# EAGLE schematic data_proV2 (EAGLE 7.6.0)
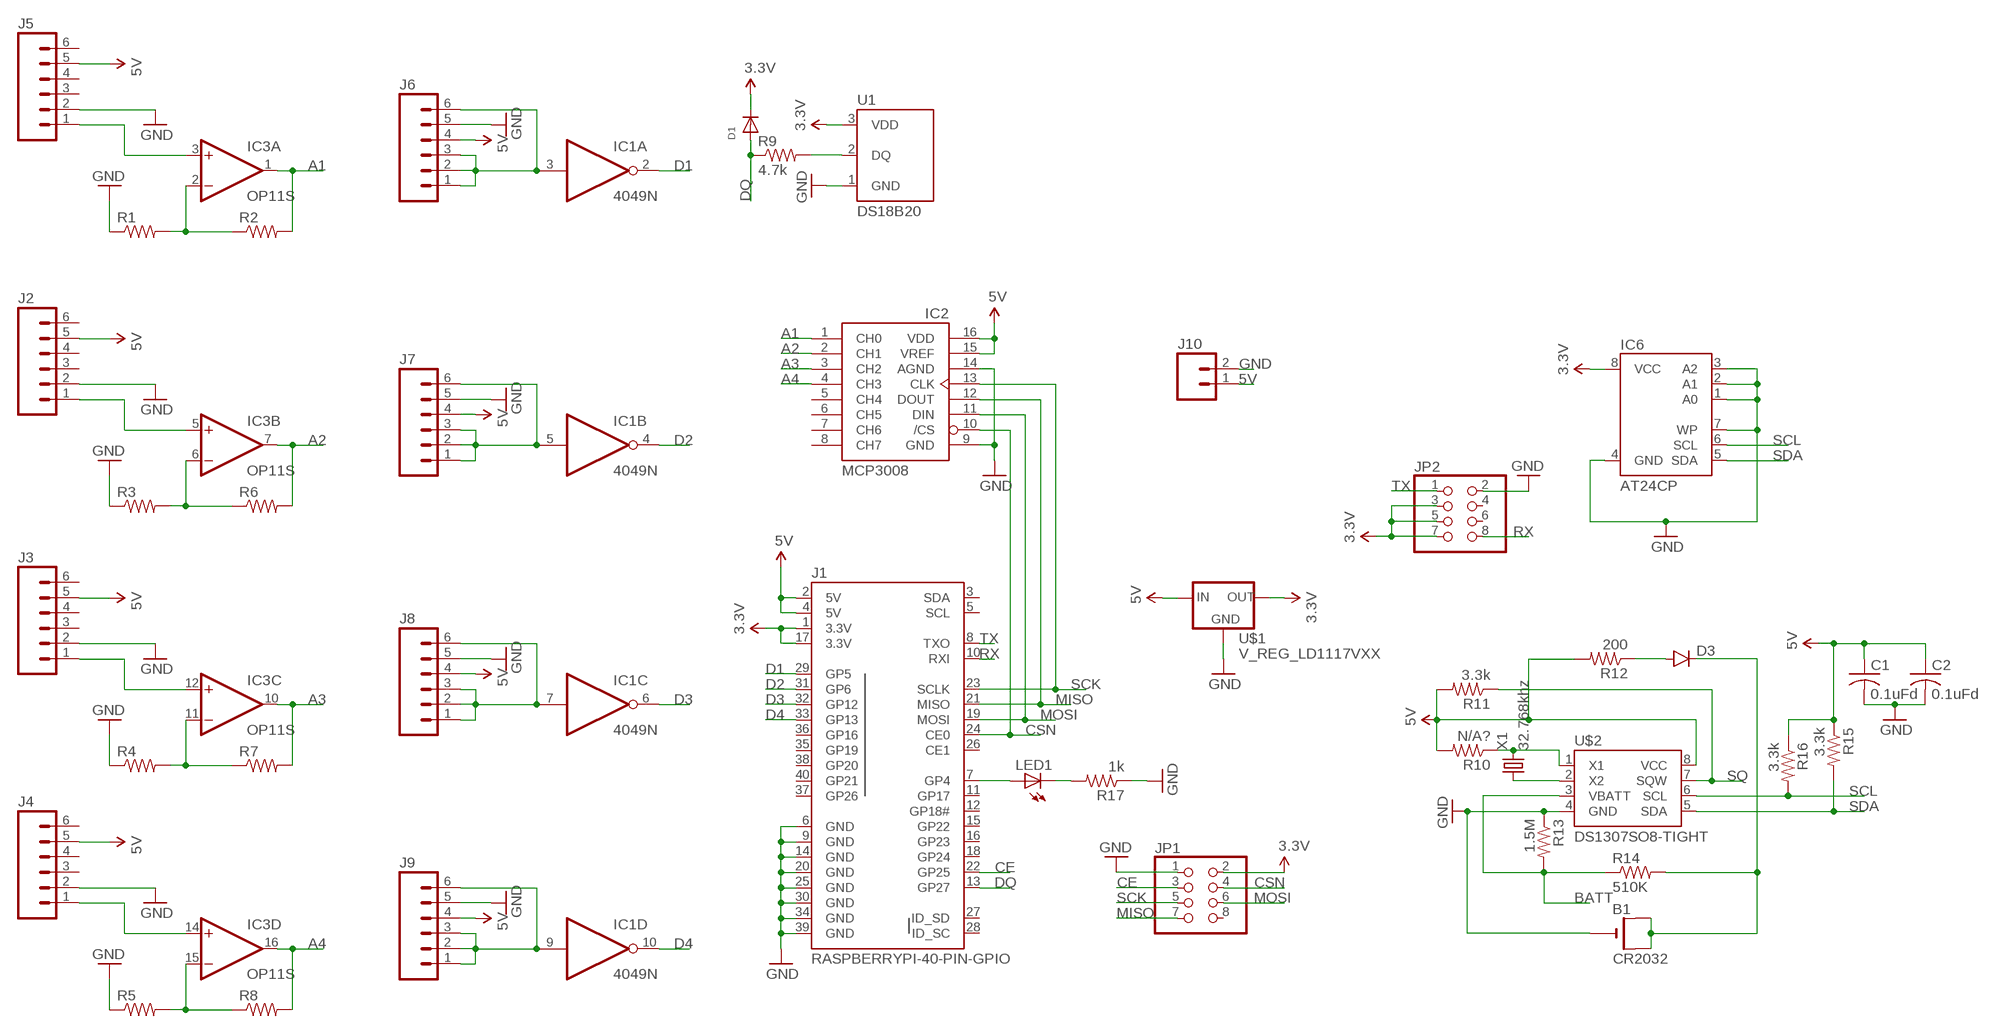
[diagram p0: schematic, sheet 1]

## Parts
B1  CR2032  CR2032SMT  [CR2032-SMD]
C1  0.1uFd  C-USC0805  [C0805]
C2  0.1uFd  C-USC0805  [C0805]
D1  DIODESOD-323F  [SOD-323F]
D3  DIODESMB  [SMB-DIODE]
IC1  4049N  [DIL16]
IC2  MCP3008  [DIL16]
IC3  OP11S  [DIL16]
IC6  AT24CP  [DIL08]
J1  RASPBERRYPI-40-PIN-GPIO  [2X20-SHROUDED]
J2  M06VERNIER-ANALOG  [BTA]
J3  M06VERNIER-ANALOG  [BTA]
J4  M06VERNIER-ANALOG  [BTA]
J5  M06VERNIER-ANALOG  [BTA]
J6  M06VERNIER-DIGITAL  [BTD]
J7  M06VERNIER-DIGITAL  [BTD]
J8  M06VERNIER-DIGITAL  [BTD]
J9  M06VERNIER-DIGITAL  [BTD]
J10  M02PTH  [1X02]
JP1  PINHD-2X4  [2X04]
JP2  PINHD-2X4  [2X04]
LED1  LEDCHIP-LED0805  [CHIP-LED0805]
R1  R-US_R0805  [R0805]
R2  R-US_R0805  [R0805]
R3  R-US_R0805  [R0805]
R4  R-US_R0805  [R0805]
R5  R-US_R0805  [R0805]
R6  R-US_R0805  [R0805]
R7  R-US_R0805  [R0805]
R8  R-US_R0805  [R0805]
R9  4.7k  R-US_R0805  [R0805]
R10  N/A?  R-US_R0805  [R0805]
R11  3.3k  R-US_R0805  [R0805]
R12  200  R-US_R0805  [R0805]
R13  1.5M  R-US_R0805  [R0805]
R14  510K  R-US_R0805  [R0805]
R15  3.3k  R-US_R0805  [R0805]
R16  3.3k  R-US_R0805  [R0805]
R17  1k  R-US_R0805  [R0805]
U1  DS18B20  [TO-92-AMMO]
U$1  V_REG_LD1117VXX  [78XXL]
U$2  DS1307SO8-TIGHT  [SO08-TIGHT]
X1  32.768khz  CRYSTALTC38H  [TC38H]

## Nets
3.3V: D1.C IC6.8(VCC) J1.1(3.3V) J1.17(3.3V) JP1.2 JP2.3 JP2.5 JP2.7 U1.3(VDD) U$1.GND(OUT)
5V: C1.1 C2.1 IC2.15(VREF) IC2.16(VDD) J1.2(5V) J1.4(5V) J2.5 J3.5 J4.5 J5.5 J6.4 J7.4 J8.4 J9.4 J10.1 R10.2 R11.2 R12.2 R15.1 R16.1 U$1.OUT(IN) U$2.8(VCC)
A1: IC2.1(CH0) IC3.1(A:OUT) R2.2
A2: IC2.2(CH1) IC3.7(B:OUT) R6.2
A3: IC2.3(CH2) IC3.10(C:OUT) R7.2
A4: IC2.4(CH3) IC3.16(D:OUT) R8.2
BATT: R13.2 R14.1 U$2.3(VBATT)
CE: J1.22(GP25) JP1.3
CSN: IC2.10(/CS) J1.24(CE0) JP1.4
D1: IC1.2(A:O) J1.29(GP5)
D2: IC1.4(B:O) J1.31(GP6)
D3: IC1.6(C:O) J1.32(GP12)
D4: IC1.10(D:O) J1.33(GP13)
DQ: D1.A J1.13(GP27) R9.1
GND: B1.- C1.2 C2.2 IC2.9(GND) IC2.14(AGND) IC6.1(A0) IC6.2(A1) IC6.3(A2) IC6.4(GND) IC6.7(WP) J1.6(GND) J1.9(GND) J1.14(GND) J1.20(GND) J1.25(GND) J1.30(GND) J1.34(GND) J1.39(GND) J2.2 J3.2 J4.2 J5.2 J6.5 J7.5 J8.5 J9.5 J10.2 JP1.1 JP2.2 R1.1 R3.1 R4.1 R5.1 R13.1 R17.1 U1.1(GND) U$1.IN(GND) U$2.4(GND)
MISO: IC2.12(DOUT) J1.21(MISO) JP1.7
MOSI: IC2.11(DIN) J1.19(MOSI) JP1.6
N$1: U$2.2(X2) X1.1
N$2: R10.1 U$2.1(X1) X1.2
N$3: B1.+$1(+) B1.+$2(+1) D3.C R14.2
N$4: J1.7(GP4) LED1.A
N$5: IC3.2(A:-IN) R1.2 R2.1
N$6: R9.2 U1.2(DQ)
N$7: IC3.15(D:-IN) R5.2 R8.1
N$8: IC3.6(B:-IN) R3.2 R6.1
N$10: D3.A R12.1
N$11: IC1.3(A:I) J6.1 J6.2 J6.3 J6.6
N$12: IC1.5(B:I) J7.1 J7.2 J7.3 J7.6
N$14: IC1.7(C:I) J8.1 J8.2 J8.3 J8.6
N$15: IC1.9(D:I) J9.1 J9.2 J9.3 J9.6
N$16: IC3.11(C:-IN) R4.2 R7.1
N$17: LED1.C R17.2
RX: J1.10(RXI) JP2.8
S1-5V1: IC3.5(B:+IN) J2.1
S1-5V2: IC3.12(C:+IN) J3.1
S1-5V3: IC3.3(A:+IN) J5.1
S1-5V4: IC3.14(D:+IN) J4.1
SCK: IC2.13(CLK) J1.23(SCLK) JP1.5
SCL: IC6.6(SCL) R16.2 U$2.6(SCL)
SDA: IC6.5(SDA) R15.2 U$2.5(SDA)
SQ: R11.1 U$2.7(SQW)
TX: J1.8(TXO) JP2.1
Unconnected: IC1.11(E:I) IC1.12(E:O) IC1.14(F:I) IC1.15(F:O) IC2.5(CH4) IC2.6(CH5) IC2.7(CH6) IC2.8(CH7) J1.3(SDA) J1.5(SCL) J1.11(GP17) J1.12(GP18#) J1.15(GP22) J1.16(GP23) J1.18(GP24) J1.26(CE1) J1.27(ID_SD) J1.28(ID_SC) J1.35(GP19) J1.36(GP16) J1.37(GP26) J1.38(GP20) J1.40(GP21) J2.3 J2.4 J2.6 J3.3 J3.4 J3.6 J4.3 J4.4 J4.6 J5.3 J5.4 J5.6 JP1.8 JP2.4 JP2.6

## Power pins joined to a net without a drawn wire
V+: IC3.4(P:V+)
V-: IC3.13(P:V-)
VDD: IC1.1(P:VDD)
VSS: IC1.8(P:VSS)

## Library data of the parts
B1 = adafruit:CR2032
C1 C2 = resistor:C-US: CAPACITOR, American symbol
D1 = adafruit:DIODE: Diode
D3 = SparkFun-DiscreteSemi:DIODE: Diode; PROD_ID: DIO-09646
IC1 = 40xx:4049: Hex inverting BUFFER
IC2 = adafruit:MCP3008
IC3 = linear:OP11: Quad Low-Offset Low-Power OP AMP The OP-11 is pin compatible with the OP-400 , LM148, HA4741, RM4156, and LT1014 operational amplifiers source http://products.analog.com/products/info.asp?product=OP400
IC6 = atmel:AT24C*: 2-wire serial EEPROM; MPN: AT24C1024BW-SH-B; OC_FARNELL: 1362646; OC_NEWARK: 03P2044
J1 = SparkFun-Boards:RASPBERRYPI-40-PIN-GPIO: Second Generation Raspberry Pi GPIO Header 2x20 pin connector, as found on B, B+, A+ models.
J2-J9 = SparkFun-Connectors:M06: Header 6 Standard 6-pin 0.1" header. Use with straight break away headers (SKU : PRT-00116), right angle break away headers (PRT-00553), swiss pins (PRT-00743), machine pins (PRT-00117), and female headers (PRT-00115). Molex polarized connector foot print use with SKU : PRT-08094 with associated crimp pins and housings. NOTES ON THE VARIANTS LOCK and LOCK_LONGPADS... This footprint was designed to help hold the alignment of a through-hole component (i.e. 6-pin header) while soldering it into place. You may notice that each hole has been shifted either up or down by 0.005 of an inch from it's more standard position (which is a perfectly straight line). This slight alteration caused the pins (the squares in the middle) to touch the edges of the holes. Because they are alternating, it causes a "brace" to hold the component in place. 0.005 has proven to be the perfect amount of "off-center" position when using our standard breakaway headers. Although looks a little odd when you look at the bare footprint, once you have a header in there, the alteration is very hard to notice. Also,if you push a header all the way into place, it is covered up entirely on the bottom side. This idea of altering the position of holes to aid alignment will be further integrated into the Sparkfun Library for other footprints. It can help hold any component with 3 or more connection pins.
J10 = SparkFun-Connectors:M02: Standard 2-pin 0.1" header. Use with - straight break away headers ( PRT-00116) - right angle break away headers (PRT-00553) - swiss pins (PRT-00743) - machine pins (PRT-00117) - female headers (PRT-00115) Molex polarized connector foot print use with: PRT-08233 with associated crimp pins and housings. 2.54_SCREWTERM for use with PRT-10571. 3.5mm Screw Terminal footprints for PRT-08084 5mm Screw Terminal footprints for use with PRT-08432
JP1 = pinhead:PINHD-2X4: PIN HEADER
JP2 = adafruit:PINHD-2X4: PIN HEADER
LED1 = led:LED: LED OSRAM: - CHIPLED LG R971, LG N971, LY N971, LG Q971, LY Q971, LO R971, LY R971 LH N974, LH R974 LS Q976, LO Q976, LY Q976 LO Q996 - Hyper CHIPLED LW Q18S LB Q993, LB Q99A, LB R99A - SideLED LS A670, LO A670, LY A670, LG A670, LP A670 LB A673, LV A673, LT A673, LW A673 LH A674 LY A675 LS A676, LA A676, LO A676, LY A676, LW A676 LS A679, LY A679, LG A679 - Hyper Micro SIDELED® LS Y876, LA Y876, LO Y876, LY Y876 LT Y87S - SmartLED LW L88C, LW L88S LB L89C, LB L89S, LG L890 LS L89K, LO L89K, LY L89K LS L896, LA L896, LO L896, LY L896 - TOPLED LS T670, LO T670, LY T670, LG T670, LP T670 LSG T670, LSP T670, LSY T670, LOP T670, LYG T670 LG T671, LOG T671, LSG T671 LB T673, LV T673, LT T673, LW T673 LH T674 LS T676, LA T676, LO T676, LY T676, LB T676, LH T676, LSB T676, LW T676 LB T67C, LV T67C, LT T67C, LS T67K, LO T67K, LY T67K, LW E67C LS E67B, LA E67B, LO E67B, LY E67B, LB E67C, LV E67C, LT E67C LW T67C LS T679, LY T679, LG T679 LS T770, LO T770, LY T770, LG T770, LP T770 LB T773, LV T773, LT T773, LW T773 LH T774 LS E675, LA E675, LY E675, LS T675 LS T776, LA T776, LO T776, LY T776, LB T776 LHGB T686 LT T68C, LB T68C - Hyper Mini TOPLED® LB M676 - Mini TOPLED Santana® LG M470 LS M47K, LO M47K, LY M47K Source: http://www.osram.convergy.de LUXEON: - LUMILED® LXK2-PW12-R00, LXK2-PW12-S00, LXK2-PW14-U00, LXK2-PW14-V00 LXK2-PM12-R00, LXK2-PM12-S00, LXK2-PM14-U00 LXK2-PE12-Q00, LXK2-PE12-R00, LXK2-PE12-S00, LXK2-PE14-T00, LXK2-PE14-U00 LXK2-PB12-K00, LXK2-PB12-L00, LXK2-PB12-M00, LXK2-PB14-N00, LXK2-PB14-P00, LXK2-PB14-Q00 LXK2-PR12-L00, LXK2-PR12-M00, LXK2-PR14-Q00, LXK2-PR14-R00 LXK2-PD12-Q00, LXK2-PD12-R00, LXK2-PD12-S00 LXK2-PH12-R00, LXK2-PH12-S00 LXK2-PL12-P00, LXK2-PL12-Q00, LXK2-PL12-R00 Source: www.luxeon.com KINGBRIGHT: KA-3528ASYC Source: www.kingbright.com
R1-R9 = resistor:R-US_: RESISTOR, American symbol
R10-R17 = adafruit:R-US_: RESISTOR, American symbol
U1 = SparkFun-Sensors:DS18B20: Dallas/Maxim DS18B20 1-wire temperature sensor Datasheet: http://datasheets.maximintegrated.com/en/ds/DS18B20.pdf temp thermometer 1-wire one-wire one wire; STORE_ID: SEN-00245
U$1 = SparkFun-PowerIC:V_REG_LD1117VXX: LD1117VXX voltage regulator. We carry the 3.3V version (COM-00526) in TO-220 package.
U$2 = SparkFun-FreqCtrl:DS1307: I2C real-time clock with battery backup.; PROD_ID: IC-08138
X1 = crystal:CRYSTAL: CRYSTAL; OC_FARNELL: unknown; OC_NEWARK: unknown